# EAGLE schematic S7G7_footprint_simplified_w_ethernet_v1p18 (EAGLE 9.5.2)
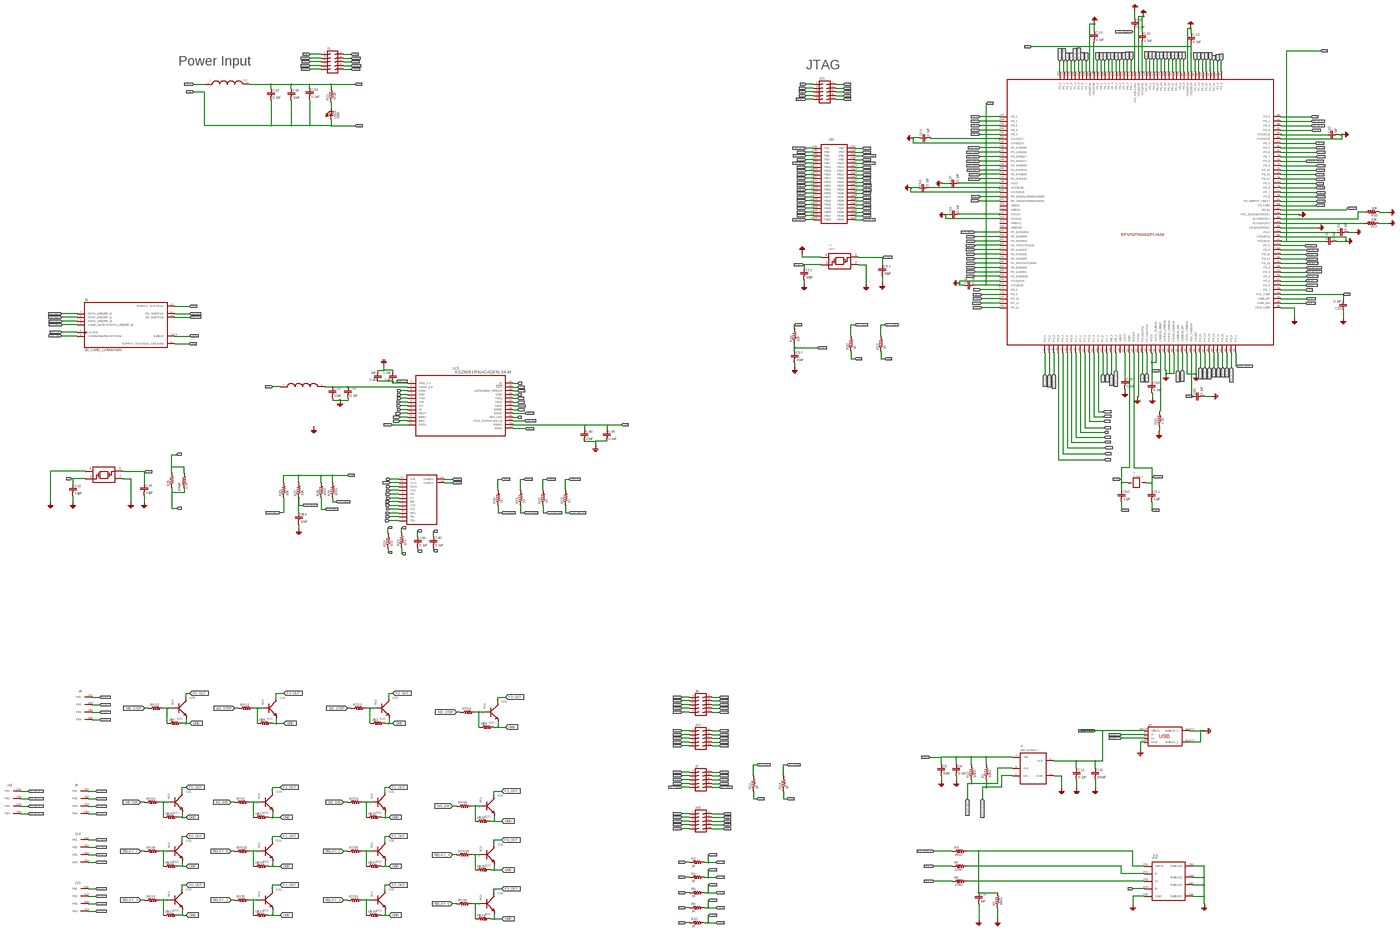
[diagram p0: schematic, sheet 1, overview]
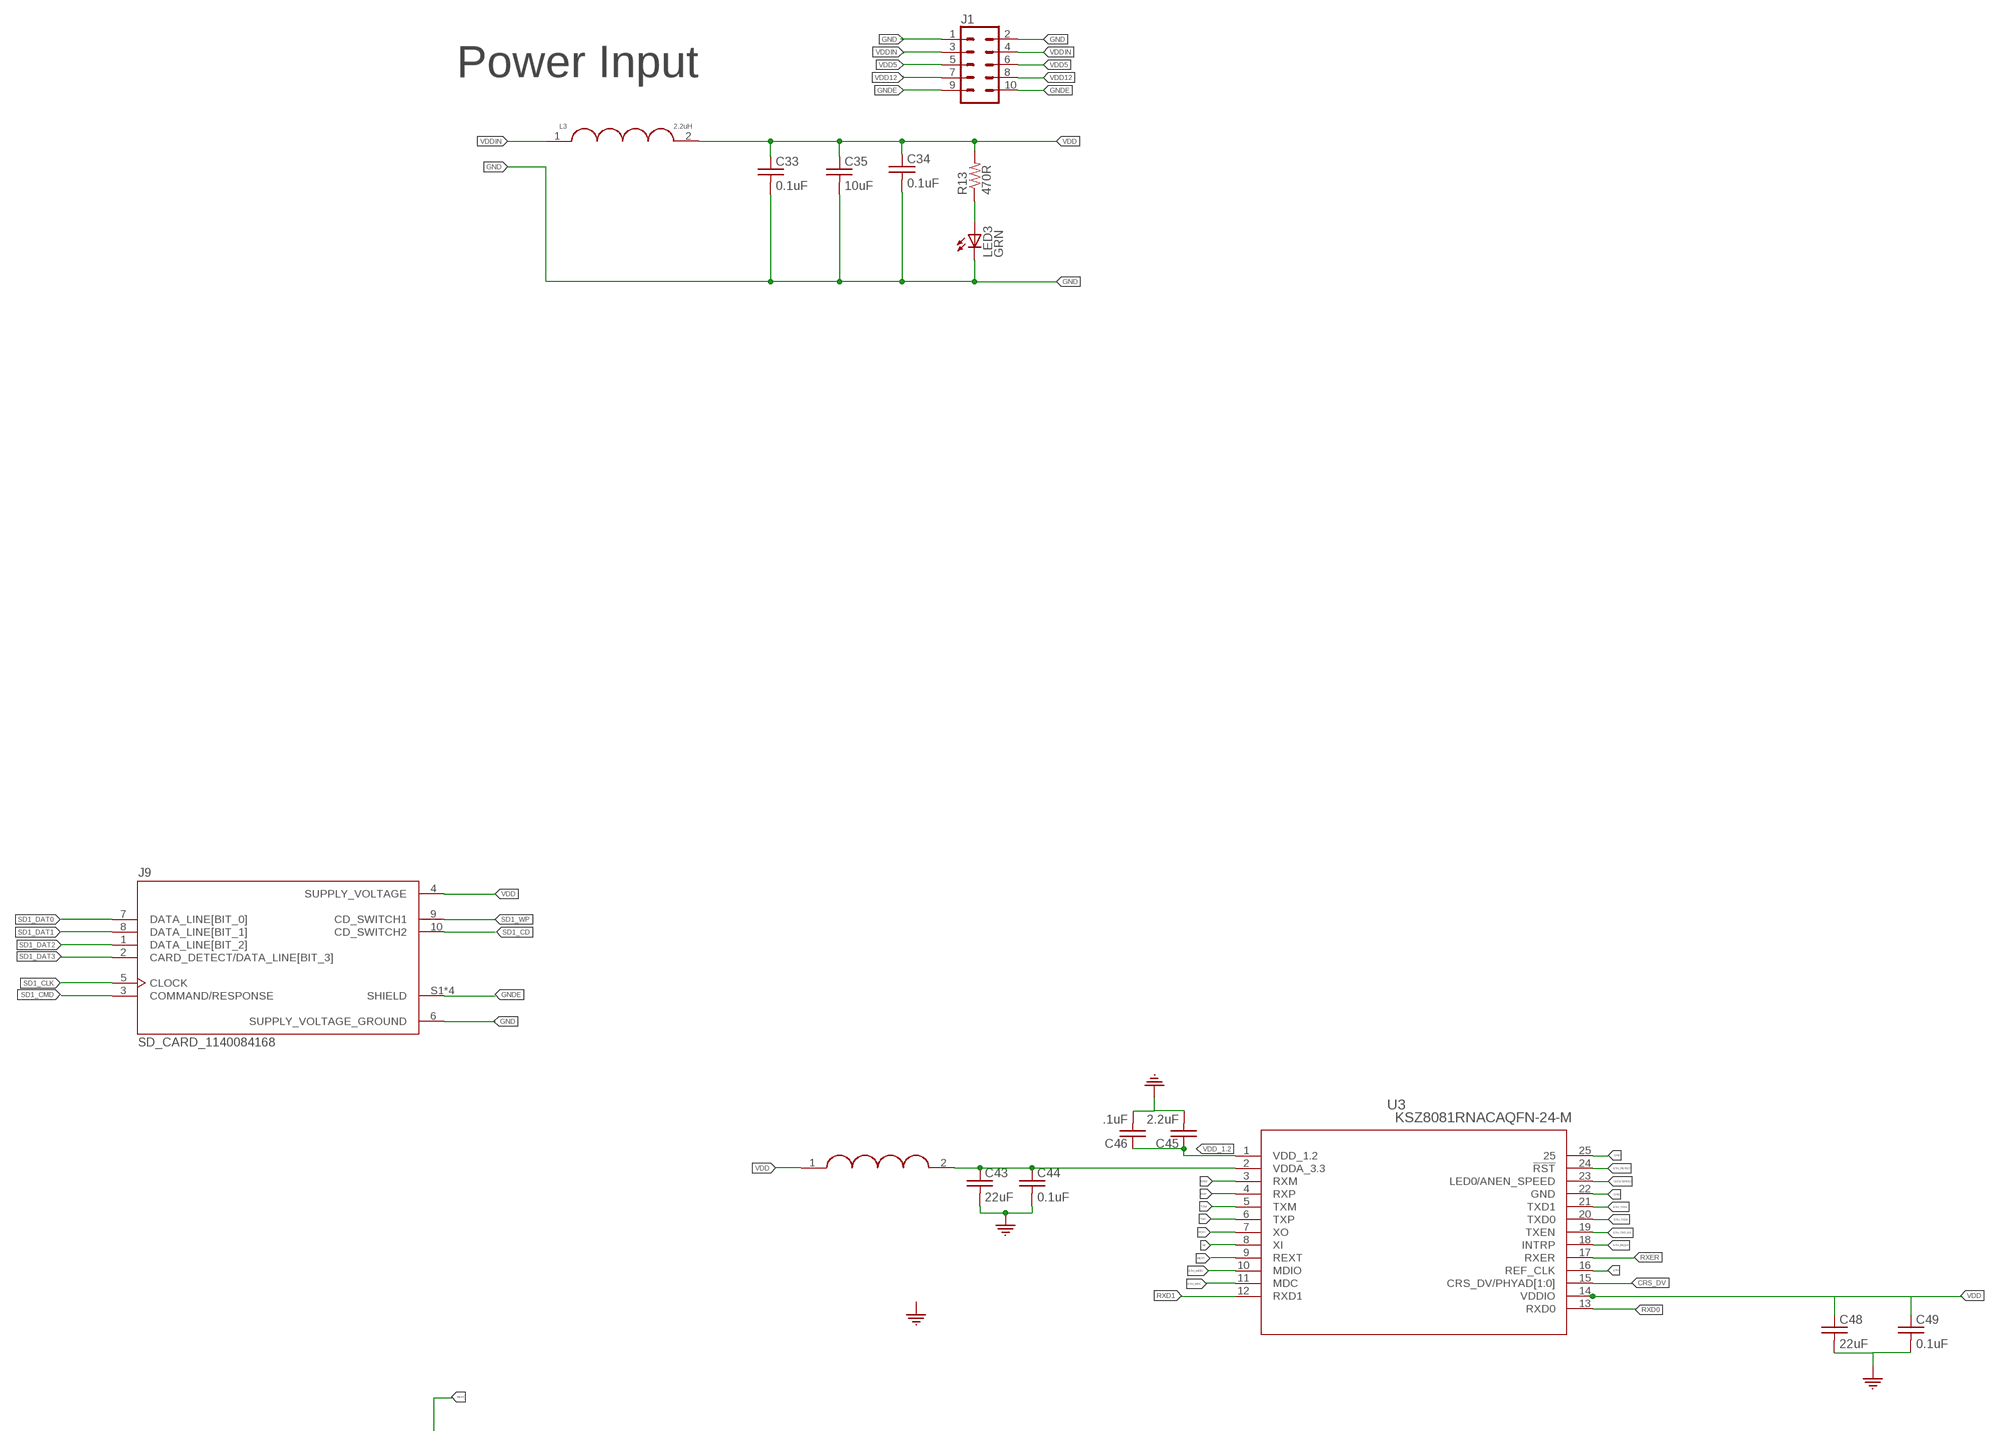
[diagram p1: schematic, sheet 1, part 1 of 4]
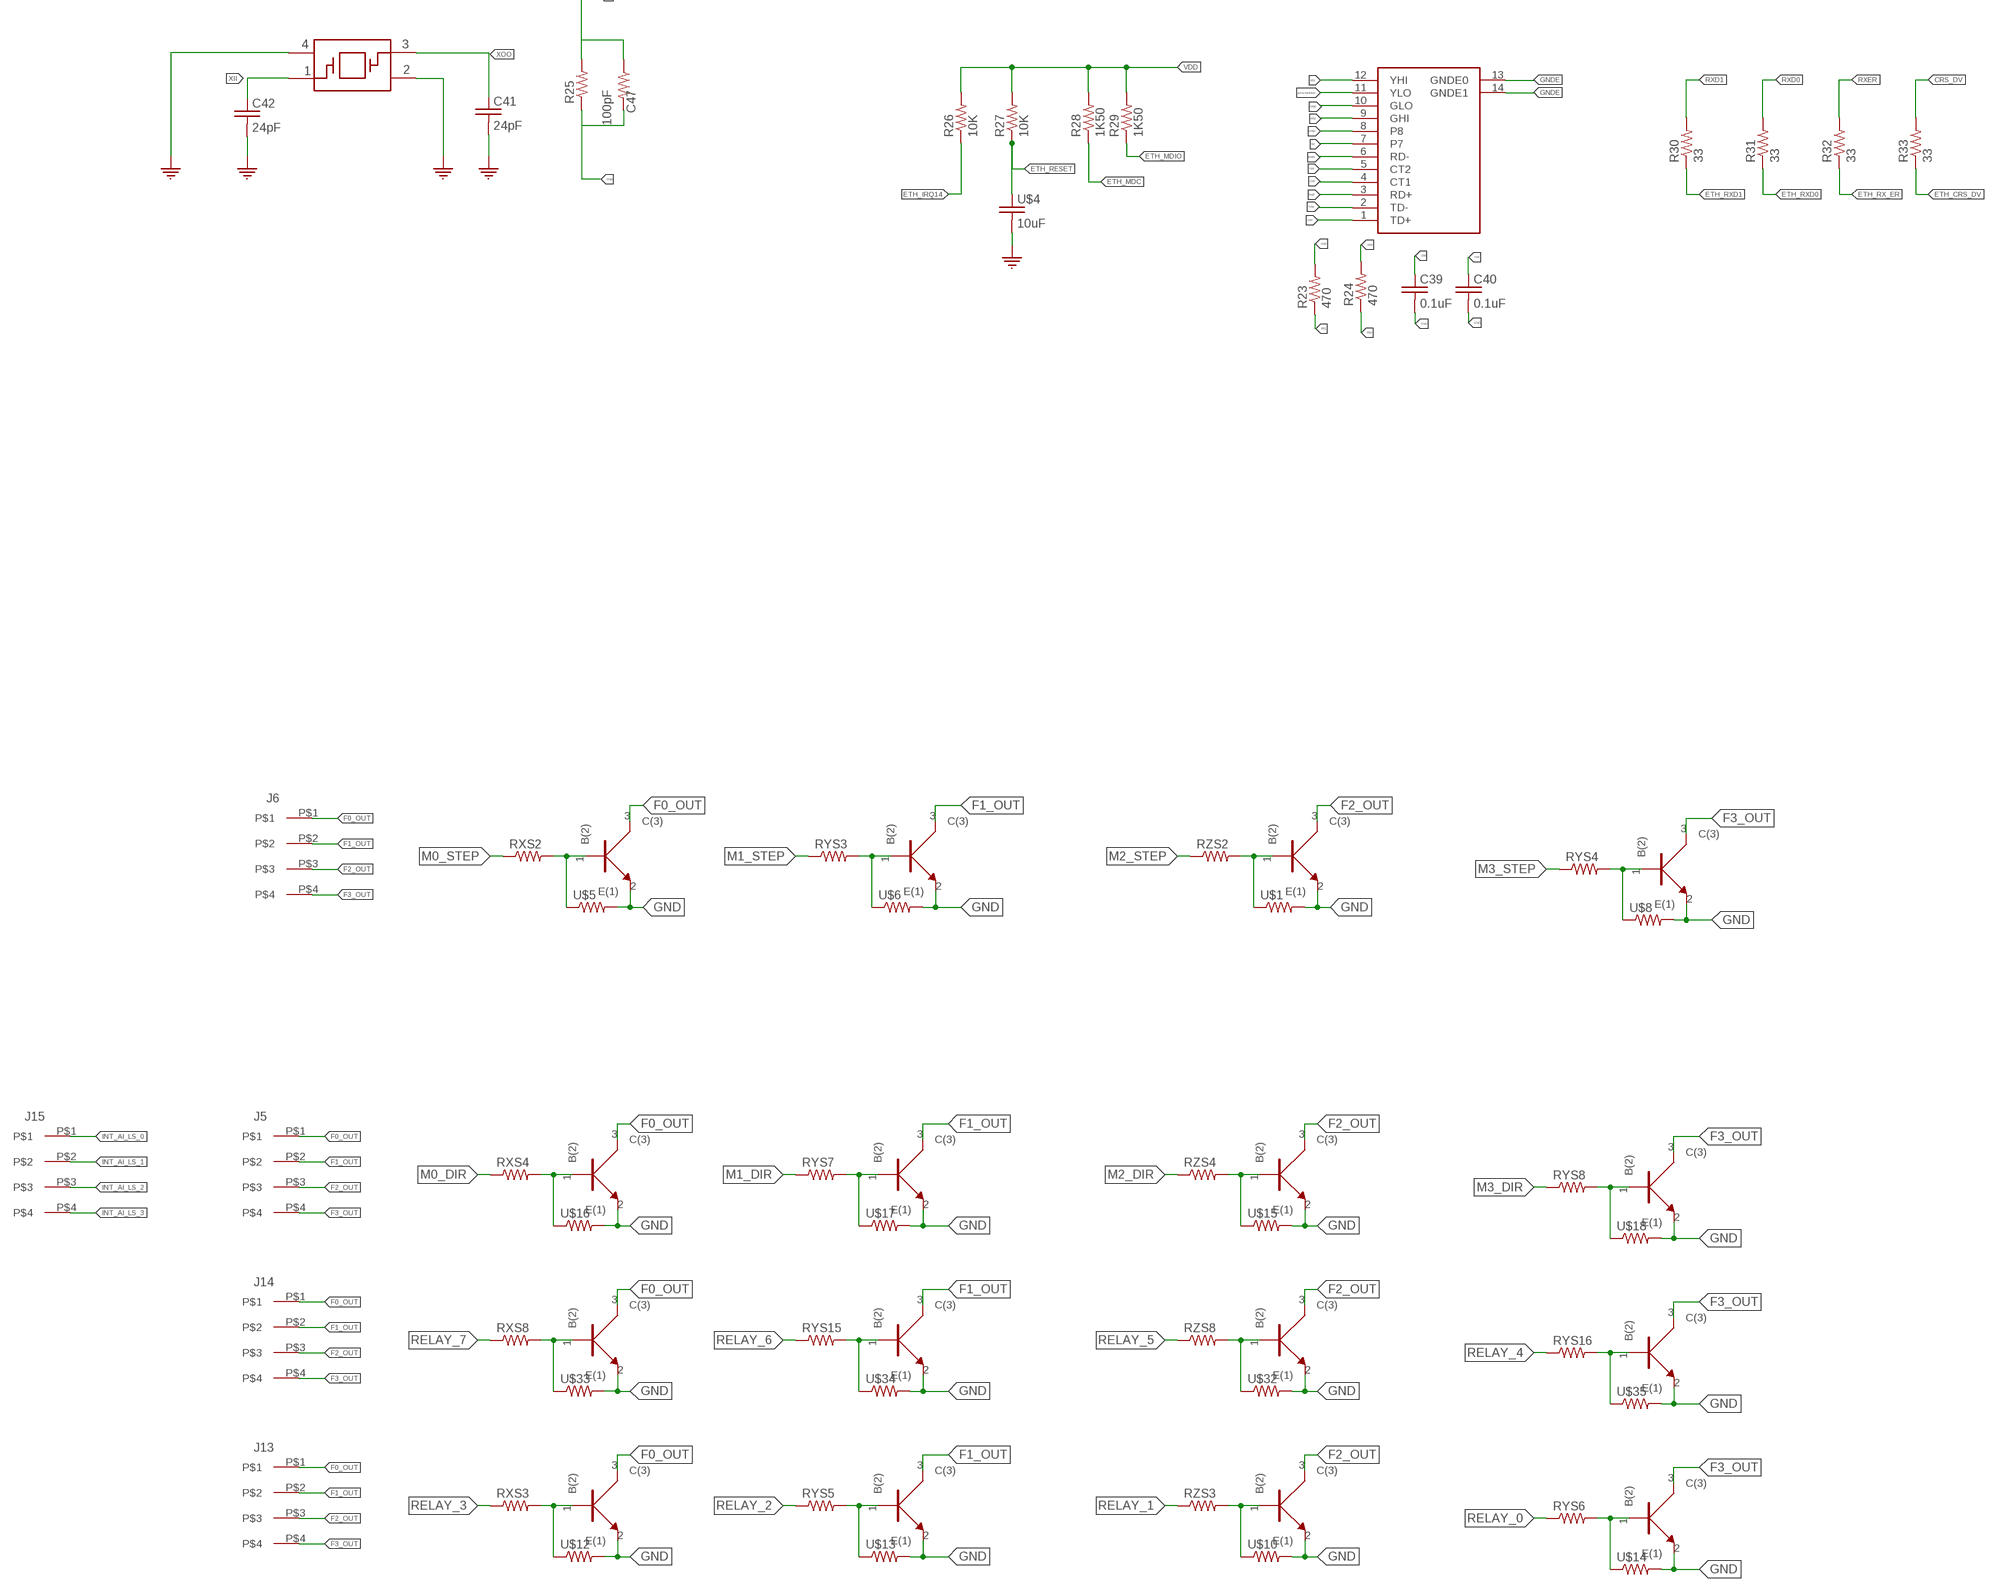
[diagram p2: schematic, sheet 1, part 2 of 4]
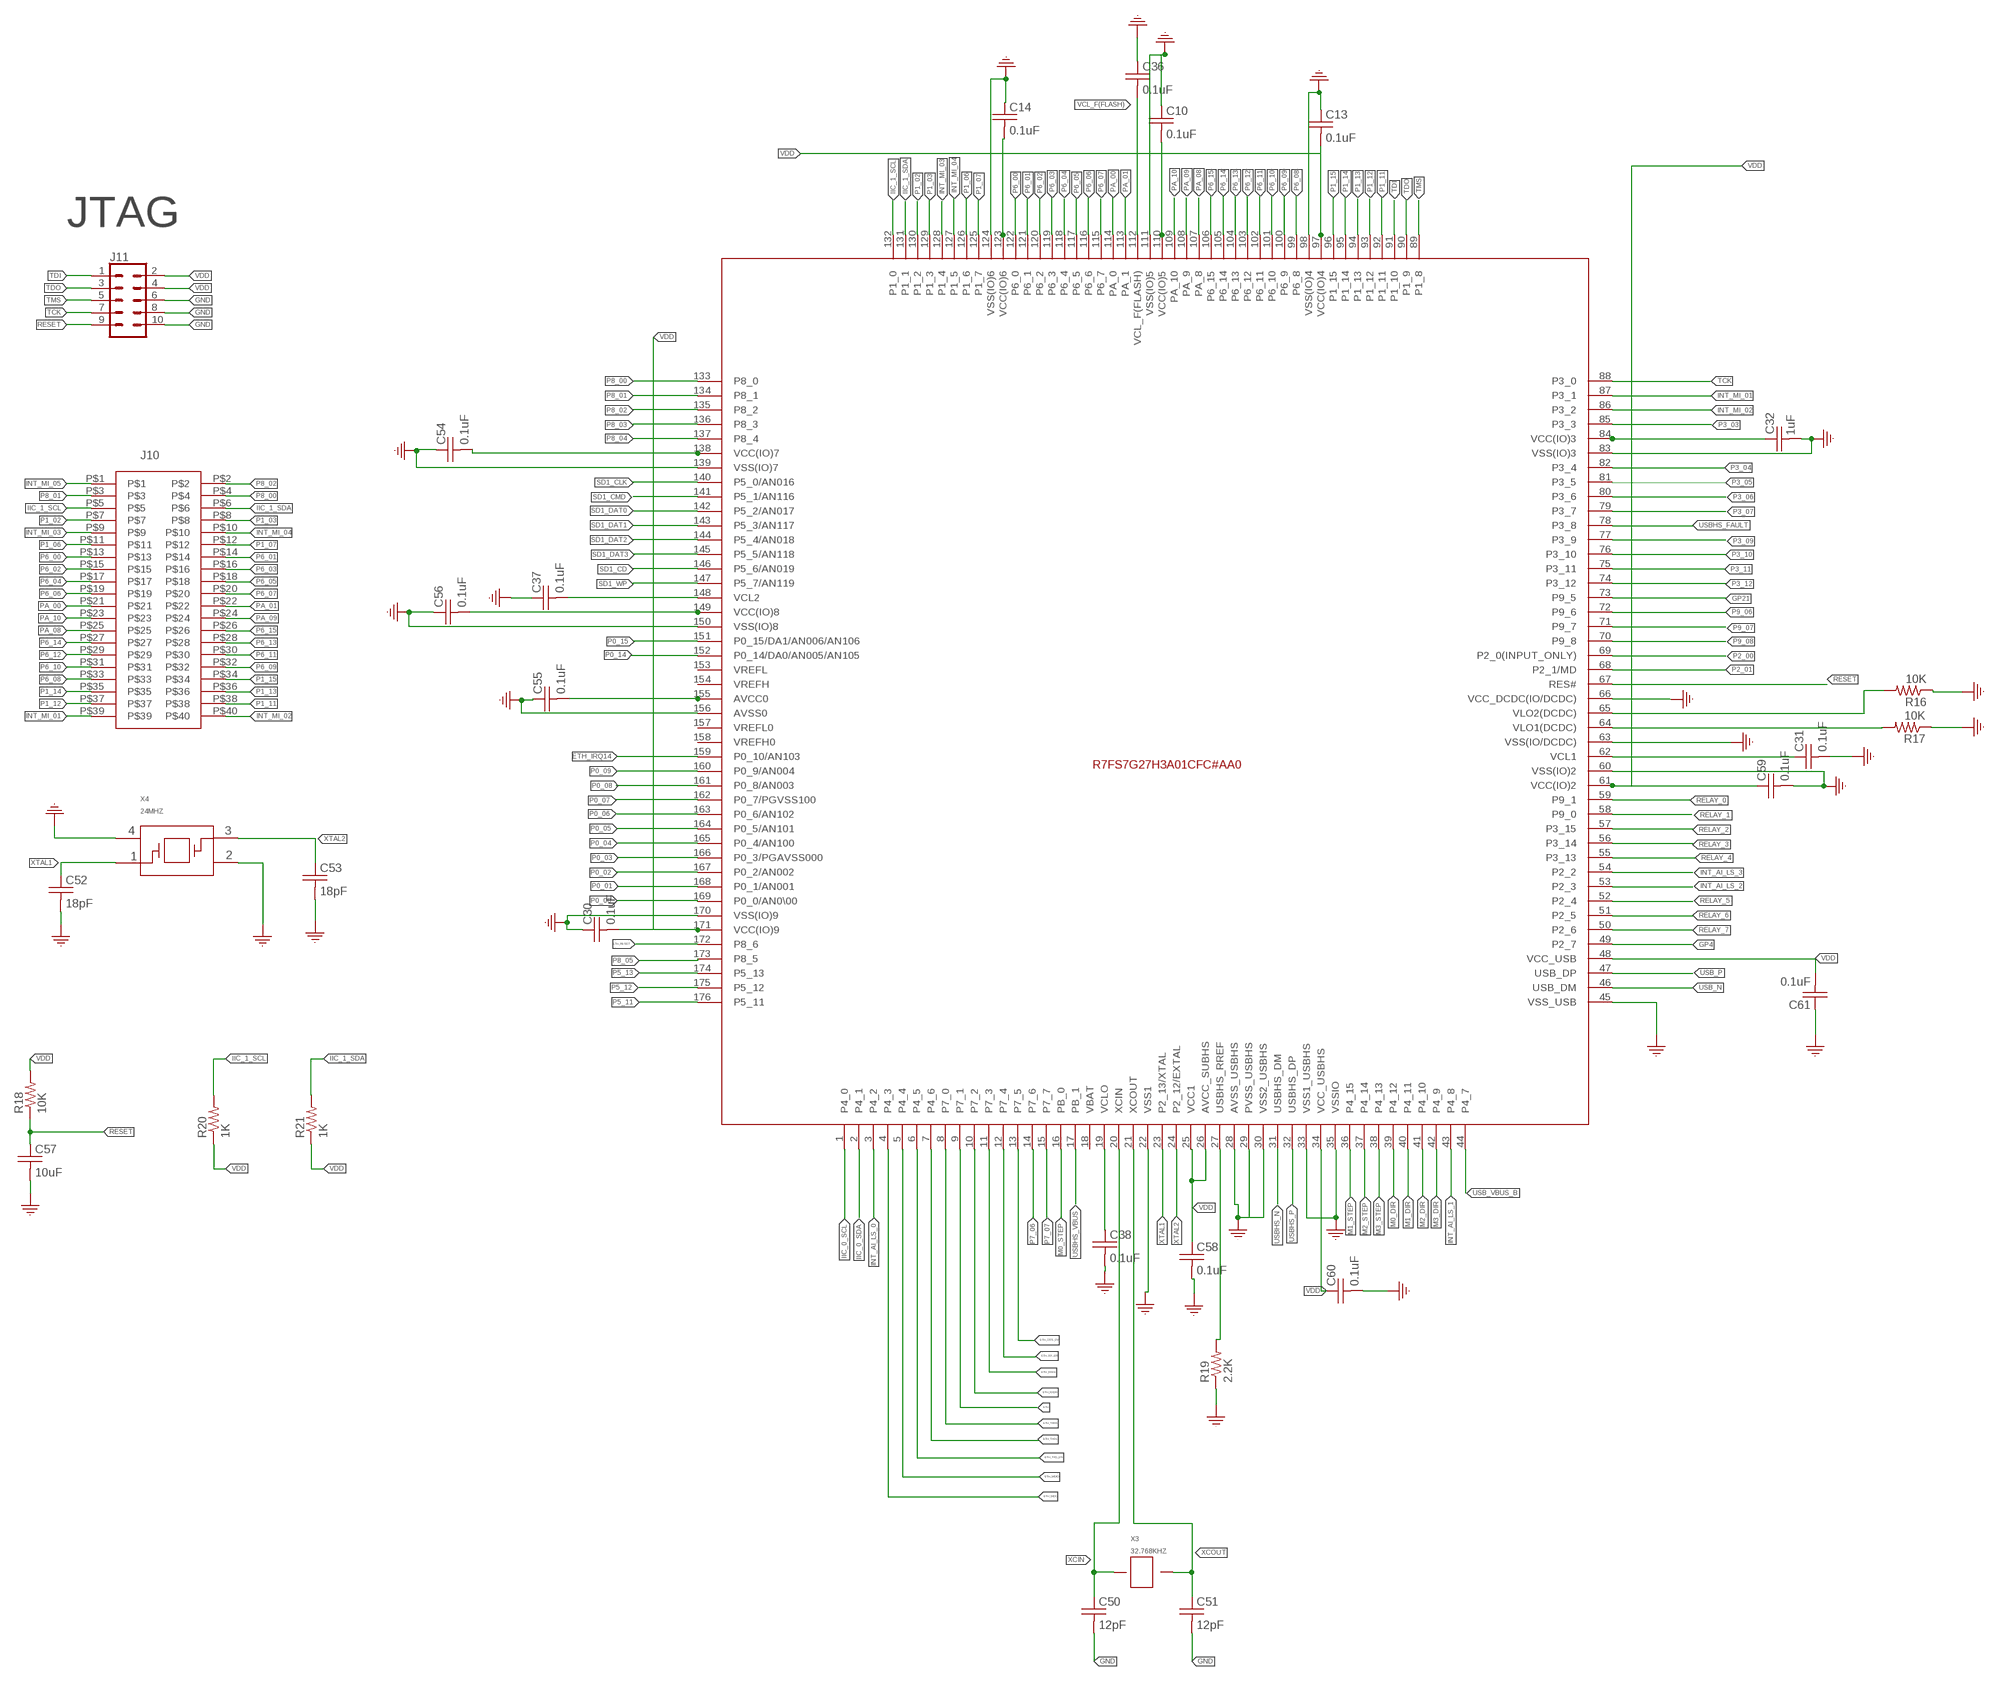
[diagram p3: schematic, sheet 1, part 3 of 4]
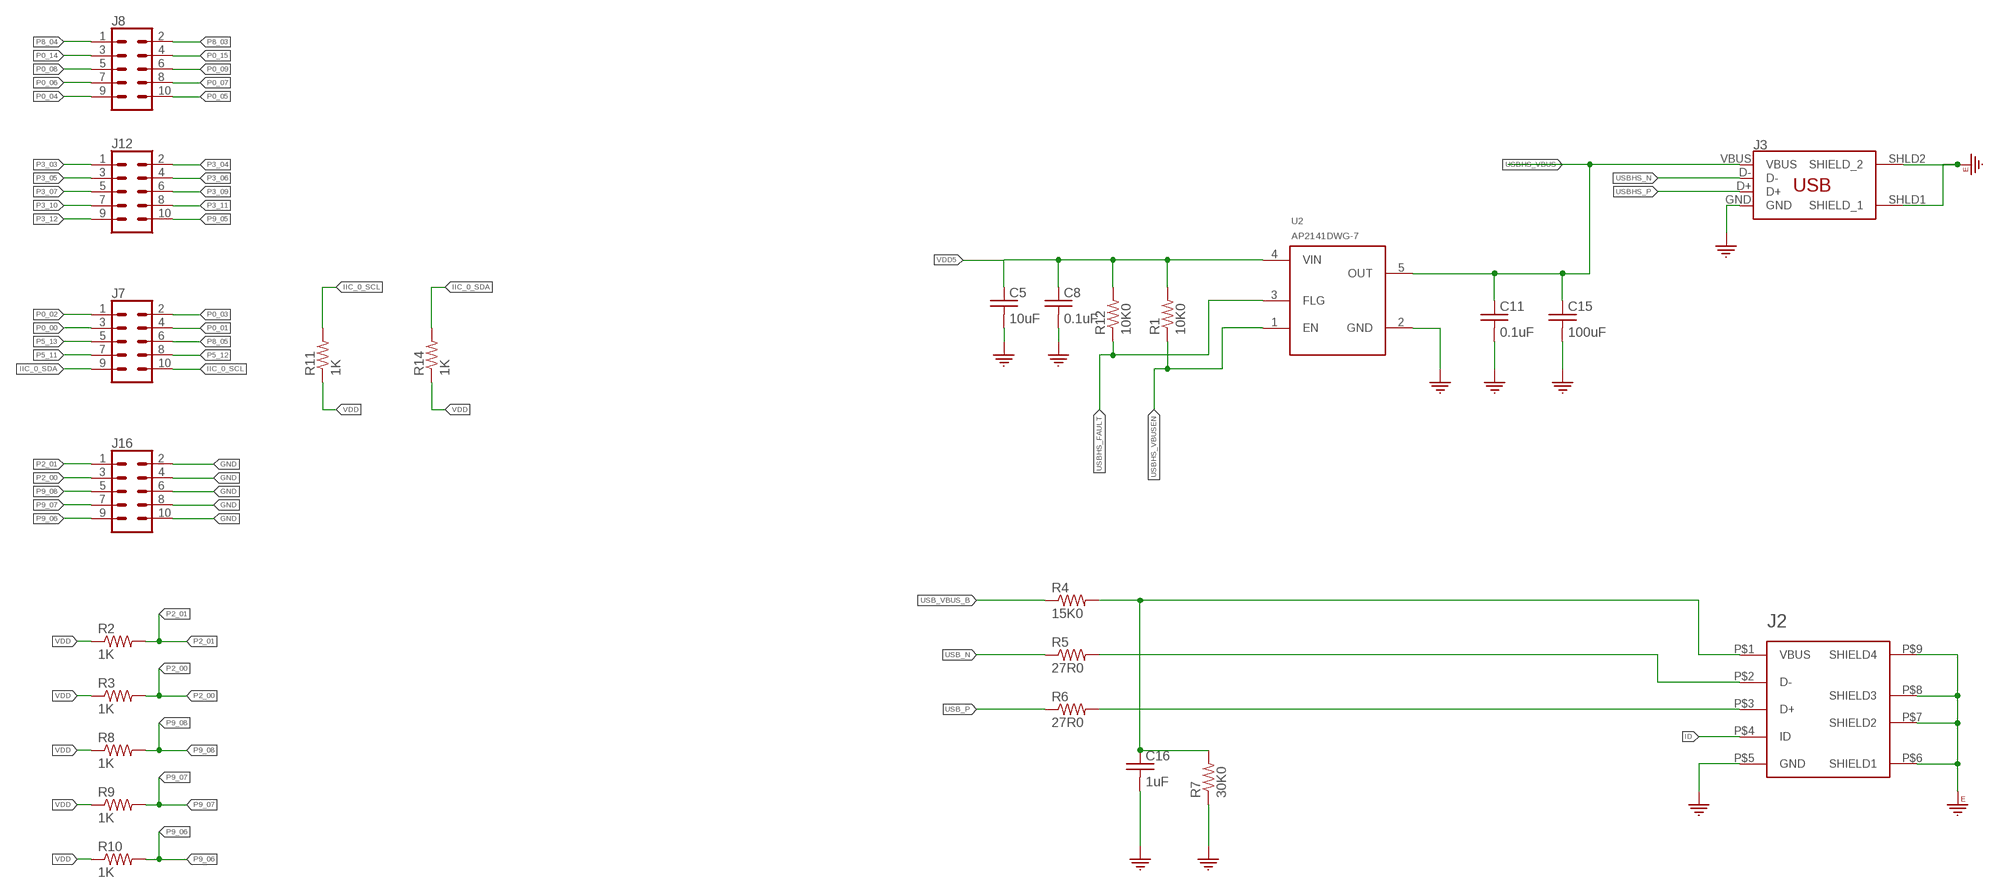
[diagram p4: schematic, sheet 1, part 4 of 4]

## Parts
C5  10uF  C_0402  [0402]
C8  0.1uF  C_0402  [0402]
C10  0.1uF  C_0402  [0402]
C11  0.1uF  C_0402  [0402]
C13  0.1uF  C_0402  [0402]
C14  0.1uF  C_0402  [0402]
C15  100uF  C_1210  [C1210]
C16  1uF  C_0402  [0402]
C30  0.1uF  C_0402  [0402]
C31  0.1uF  C_0402  [0402]
C32  1uF  C_0402  [0402]
C33  0.1uF  C_0402  [0402]
C34  0.1uF  C_0402  [0402]
C35  10uF  C_0402  [0402]
C36  0.1uF  C_0402  [0402]
C37  0.1uF  C_0402  [0402]
C38  0.1uF  C_0402  [0402]
C39  0.1uF  C_0402  [0402]
C40  0.1uF  C_0402  [0402]
C41  24pF  C_0402  [0402]
C42  24pF  C_0402  [0402]
C43  22uF  C_0603  [0603]
C44  0.1uF  C_0402  [0402]
C45  2.2uF  C_0402  [0402]
C46  .1uF  C_0402  [0402]
C47  100pF  R_0402  [0402]
C48  22uF  C_0603  [0603]
C49  0.1uF  C_0402  [0402]
C50  12pF  C_0402  [0402]
C51  12pF  C_0402  [0402]
C52  18pF  C_0402  [0402]
C53  18pF  C_0402  [0402]
C54  0.1uF  C_0402  [0402]
C55  0.1uF  C_0402  [0402]
C56  0.1uF  C_0402  [0402]
C57  10uF  C_0402  [0402]
C58  0.1uF  C_0402  [0402]
C59  0.1uF  C_0402  [0402]
C60  0.1uF  C_0402  [0402]
C61  0.1uF  C_0402  [0402]
FB2/2  FB_0805_120_OHM  [0805]
J1  CONN_05X2PTH  [2X5]
J2  USB_MICRO-B  [USB_MICRO-B]
J3  USB_A  [USB_A_SMT]
J4  RJ45_WITH_ELEC  [RJ45_TH_ELEC]
J5  3.81MM_1_X_4_RT_ANGLE_PLUG_HEADER  [1X4_3.81MM_PITCH]
J6  3.81MM_1_X_4_RT_ANGLE_PLUG_HEADER  [1X4_3.81MM_PITCH]
J7  CONN_05X2NO_SILK  [2X5_NOSILK]
J8  CONN_05X2NO_SILK  [2X5_NOSILK]
J9  SD_CARD_1140084168  [AMPHENOL_1140084168]
J10  HEADER_2_X_20_GENERIC  [HEADER_2_X_20_.1_INCH]
J11  CONN_05X2PTH  [2X5]
J12  CONN_05X2NO_SILK  [2X5_NOSILK]
J13  3.81MM_1_X_4_RT_ANGLE_PLUG_HEADER  [1X4_3.81MM_PITCH]
J14  3.81MM_1_X_4_RT_ANGLE_PLUG_HEADER  [1X4_3.81MM_PITCH]
J15  3.81MM_1_X_4_RT_ANGLE_PLUG_HEADER  [1X4_3.81MM_PITCH]
J16  CONN_05X2SHD_SMD  [2X5-SHROUDED_SMD]
L3  2.2uH  INDUCTOR_1008_2.2_MH_1.3A  [1008_(2520_METRIC)]
LED3  LED_0805_GREEN  [LED_0805_GREEN]
R1  10K0  R_0402  [0402]
R2  1K  R_0402  [0402]
R3  1K  R_0402  [0402]
R4  15K0  R_0402  [0402]
R5  27R0  R_0402  [0402]
R6  27R0  R_0402  [0402]
R7  30K0  R_0402  [0402]
R8  1K  R_0402  [0402]
R9  1K  R_0402  [0402]
R10  1K  R_0402  [0402]
R11  1K  R_0402  [0402]
R12  10K0  R_0402  [0402]
R13  470R  R_0402  [0402]
R14  1K  R_0402  [0402]
R16  10K  R_0402  [0402]
R17  10K  R_0402  [0402]
R18  10K  R_0402  [0402]
R19  2.2K  R_0402  [0402]
R20  1K  R_0402  [0402]
R21  1K  R_0402  [0402]
R23  470  R_0402  [0402]
R24  470  R_0402  [0402]
R25  6k49  R_0402  [0402]
R26  10K  R_0402  [0402]
R27  10K  R_0402  [0402]
R28  1K50  R_0402  [0402]
R29  1K50  R_0402  [0402]
R30  33  R_0402  [0402]
R31  33  R_0402  [0402]
R32  33  R_0402  [0402]
R33  33  R_0402  [0402]
RXS2  1K  R_0402  [0402]
RXS3  1K  R_0402  [0402]
RXS4  1K  R_0402  [0402]
RXS8  1K  R_0402  [0402]
RYS3  1K  R_0402  [0402]
RYS4  1K  R_0402  [0402]
RYS5  1K  R_0402  [0402]
RYS6  1K  R_0402  [0402]
RYS7  1K  R_0402  [0402]
RYS8  1K  R_0402  [0402]
RYS15  1K  R_0402  [0402]
RYS16  1K  R_0402  [0402]
RZS2  1K  R_0402  [0402]
RZS3  1K  R_0402  [0402]
RZS4  1K  R_0402  [0402]
RZS8  1K  R_0402  [0402]
U2  AP2141DWG-5  [SOT-23-5]
U3  KSZ8081RNACAQFN-24-M  [QFN-24-M]
U4  S7G2_X_176  [LQFP176_24X24]
U7  BC846BW  [SOT323]
U8  BC846BW  [SOT323]
U9  BC846BW  [SOT323]
U10  BC846BW  [SOT323]
U12  BC846BW  [SOT323]
U13  BC846BW  [SOT323]
U14  BC846BW  [SOT323]
U15  BC846BW  [SOT323]
U16  BC846BW  [SOT323]
U17  BC846BW  [SOT323]
U18  BC846BW  [SOT323]
U19  BC846BW  [SOT323]
U32  BC846BW  [SOT323]
U33  BC846BW  [SOT323]
U34  BC846BW  [SOT323]
U35  BC846BW  [SOT323]
U$1  1K  R_0402  [0402]
U$3  XTAL_25_MHZ  [SMD_3225]
U$4  10uF  C_0402  [0402]
U$5  1K  R_0402  [0402]
U$6  1K  R_0402  [0402]
U$8  1K  R_0402  [0402]
U$10  1K  R_0402  [0402]
U$12  1K  R_0402  [0402]
U$13  1K  R_0402  [0402]
U$14  1K  R_0402  [0402]
U$15  1K  R_0402  [0402]
U$16  1K  R_0402  [0402]
U$17  1K  R_0402  [0402]
U$18  1K  R_0402  [0402]
U$32  1K  R_0402  [0402]
U$33  1K  R_0402  [0402]
U$34  1K  R_0402  [0402]
U$35  1K  R_0402  [0402]
X3  32.768KHZ  XTAL_32.768KHZ  [SMD_X_2_PADS]
X4  24MHZ  XTAL_24_MHZ  [SMD_3225]

## Nets
C58: C39.P$1 J4.4(CT1)
C60: C40.P$1 J4.5(CT2)
CRS_DV: R33.P$2 U3.15(CRS_DV/PHYAD[1:0])
D+: J2.P$3(D+) R6.P$2
D-: J2.P$2(D-) R5.P$2
ETH: U3.16(REF_CLK) U4.9(P7_1)
ETH_CRS_DV: R33.P$1 U4.13(P7_5)
ETH_IRQ14: R26.P$1 U3.18(INTRP) U4.159(P0_10/AN103)
ETH_MDC: R28.P$1 U3.11(MDC) U4.4(P4_3)
ETH_MDIO: R29.P$1 U3.10(MDIO) U4.5(P4_4)
ETH_RESET: R27.P$1 U3.24(!RST) U4.172(P8_6) U$4.P$1
ETH_RX_ER: R32.P$1 U4.12(P7_4)
ETH_RXD0: R31.P$1 U4.10(P7_2)
ETH_RXD1: R30.P$1 U4.11(P7_3)
ETH_TXD0: U3.20(TXD0) U4.8(P7_0)
ETH_TXD1: U3.21(TXD1) U4.7(P4_6)
ETH_TXD_EN: U3.19(TXEN) U4.6(P4_5)
F0_OUT: J5.P$1 J6.P$1 J13.P$1 J14.P$1 U8.3(C(3)) U13.3(C(3)) U17.3(C(3)) U33.3(C(3))
F1_OUT: J5.P$2 J6.P$2 J13.P$2 J14.P$2 U9.3(C(3)) U14.3(C(3)) U18.3(C(3)) U34.3(C(3))
F2_OUT: J5.P$3 J6.P$3 J13.P$3 J14.P$3 U7.3(C(3)) U12.3(C(3)) U16.3(C(3)) U32.3(C(3))
F3_OUT: J5.P$4 J6.P$4 J13.P$4 J14.P$4 U10.3(C(3)) U15.3(C(3)) U19.3(C(3)) U35.3(C(3))
GND: C5.P$2 C8.P$2 C10.P$1 C11.P$2 C13.P$1 C14.P$1 C15.2 C16.P$2 C30.P$1 C31.P$2 C32.P$2 C33.P$2 C34.P$2 C35.P$2 C36.P$1 C37.P$1 C38.P$2 C39.P$2 C40.P$2 C41.P$2 C42.P$2 C43.2 C44.P$2 C45.P$2 C46.P$2 C47.P$2 C48.2 C49.P$2 C50.P$2 C51.P$2 C52.P$2 C53.P$2 C54.P$1 C55.P$1 C56.P$1 C57.P$2 C58.P$2 C59.P$2 C60.P$2 C61.P$1 J1.1 J1.2 J2.P$5(GND) J3.GND J4.8 J4.10(GLO) J9.6(SUPPLY_VOLTAGE_GROUND) J11.6 J11.8 J11.10 J16.2 J16.4 J16.6 J16.8 J16.10 LED3.C R7.P$1 R16.P$1 R17.P$1 R19.P$1 R25.P$1 U2.2(GND) U3.22(GND) U3.25 U4.22(VSS1) U4.28(AVSS_USBHS) U4.29(PVSS_USBHS) U4.30(VSS2_USBHS) U4.33(VSS1_USBHS) U4.35(VSSIO) U4.45(VSS_USB) U4.60(VSS(IO)2) U4.63(VSS(IO/DCDC)) U4.66(VCC_DCDC(IO/DCDC)) U4.83(VSS(IO)3) U4.98(VSS(IO)4) U4.111(VSS(IO)5) U4.124(VSS(IO)6) U4.139(VSS(IO)7) U4.150(VSS(IO)8) U4.156(AVSS0) U4.170(VSS(IO)9) U7.2(E(1)) U8.2(E(1)) U9.2(E(1)) U10.2(E(1)) U12.2(E(1)) U13.2(E(1)) U14.2(E(1)) U15.2(E(1)) U16.2(E(1)) U17.2(E(1)) U18.2(E(1)) U19.2(E(1)) U32.2(E(1)) U33.2(E(1)) U34.2(E(1)) U35.2(E(1)) U$1.P$2 U$3.2 U$3.4 U$4.P$2 U$5.P$2 U$6.P$2 U$8.P$2 U$10.P$2 U$12.P$2 U$13.P$2 U$14.P$2 U$15.P$2 U$16.P$2 U$17.P$2 U$18.P$2 U$32.P$2 U$33.P$2 U$34.P$2 U$35.P$2 X4.2 X4.4
GNDE: J1.9 J1.10 J2.P$6(SHIELD1) J2.P$7(SHIELD2) J2.P$8(SHIELD3) J2.P$9(SHIELD4) J3.SHLD1(SHIELD_1) J3.SHLD2(SHIELD_2) J4.13(GNDE0) J4.14(GNDE1) J9.S1(SHIELD) J9.S2(SHIELD) J9.S3(SHIELD) J9.S4(SHIELD)
GP4: U4.49(P2_7)
GP21: U4.73(P9_5)
ID: J2.P$4(ID)
IIC_0_SCL: J7.10 R11.P$2 U4.1(P4_0)
IIC_0_SDA: J7.9 R14.P$2 U4.2(P4_1)
IIC_1_SCL: J10.P$5 R20.P$2 U4.132(P1_0)
IIC_1_SDA: J10.P$6 R21.P$2 U4.131(P1_1)
INT_AI_LS_0: J15.P$1 U4.3(P4_2)
INT_AI_LS_1: J15.P$2 U4.43(P4_8)
INT_AI_LS_2: J15.P$3 U4.53(P2_3)
INT_AI_LS_3: J15.P$4 U4.54(P2_2)
INT_MI_01: J10.P$39 U4.87(P3_1)
INT_MI_02: J10.P$40 U4.86(P3_2)
INT_MI_03: J10.P$9 U4.128(P1_4)
INT_MI_04: J10.P$10 U4.127(P1_5)
INT_MI_05: J10.P$1
LED1/SPEED: J4.11(YLO) U3.23(LED0/ANEN_SPEED)
M0_DIR: RXS4.P$1 U4.39(P4_12)
M0_STEP: RXS2.P$1 U4.16(PB_0)
M1_DIR: RYS7.P$1 U4.40(P4_11)
M1_STEP: RYS3.P$1 U4.36(P4_15)
M2_DIR: RZS4.P$1 U4.41(P4_10)
M2_STEP: RZS2.P$1 U4.37(P4_14)
M3_DIR: RYS8.P$1 U4.42(P4_9)
M3_STEP: RYS4.P$1 U4.38(P4_13)
N$1: C37.P$2 U4.148(VCL2)
N$3: LED3.A R13.P$1
N$4: C38.P$1 U4.19(VCLO)
N$5: C31.P$1 U4.62(VCL1)
N$6: R17.P$2 U4.64(VLO1(DCDC))
N$7: R16.P$2 U4.65(VLO2(DCDC))
N$8: R19.P$2 U4.27(USBHS_RREF)
N$11: RZS2.P$2 U7.1(B(2)) U$1.P$1
N$12: RXS2.P$2 U8.1(B(2)) U$5.P$1
N$13: RYS3.P$2 U9.1(B(2)) U$6.P$1
N$14: RYS4.P$2 U10.1(B(2)) U$8.P$1
N$15: RZS3.P$2 U12.1(B(2)) U$10.P$1
N$16: RXS3.P$2 U13.1(B(2)) U$12.P$1
N$17: RYS5.P$2 U14.1(B(2)) U$13.P$1
N$18: RYS6.P$2 U15.1(B(2)) U$14.P$1
N$19: RZS4.P$2 U16.1(B(2)) U$15.P$1
N$20: RXS4.P$2 U17.1(B(2)) U$16.P$1
N$22: RYS7.P$2 U18.1(B(2)) U$17.P$1
N$23: RYS8.P$2 U19.1(B(2)) U$18.P$1
N$36: RZS8.P$2 U32.1(B(2)) U$32.P$1
N$37: RXS8.P$2 U33.1(B(2)) U$33.P$1
N$38: RYS15.P$2 U34.1(B(2)) U$34.P$1
N$39: RYS16.P$2 U35.1(B(2)) U$35.P$1
NC: J4.7
P0_00: J7.3 U4.169(P0_0/AN0\00)
P0_01: J7.4 U4.168(P0_1/AN001)
P0_02: J7.1 U4.167(P0_2/AN002)
P0_03: J7.2 U4.166(P0_3/PGAVSS000)
P0_04: J8.9 U4.165(P0_4/AN100)
P0_05: J8.10 U4.164(P0_5/AN101)
P0_06: J8.7 U4.163(P0_6/AN102)
P0_07: J8.8 U4.162(P0_7/PGVSS100)
P0_08: J8.5 U4.161(P0_8/AN003)
P0_09: J8.6 U4.160(P0_9/AN004)
P0_14: J8.3 U4.152(P0_14/DA0/AN005/AN105)
P0_15: J8.4 U4.151(P0_15/DA1/AN006/AN106)
P1_02: J10.P$7 U4.130(P1_2)
P1_03: J10.P$8 U4.129(P1_3)
P1_06: J10.P$11 U4.126(P1_6)
P1_07: J10.P$12 U4.125(P1_7)
P1_11: J10.P$38 U4.92(P1_11)
P1_12: J10.P$37 U4.93(P1_12)
P1_13: J10.P$36 U4.94(P1_13)
P1_14: J10.P$35 U4.95(P1_14)
P1_15: J10.P$34 U4.96(P1_15)
P2_00: J16.3 R3.P$2 U4.69(P2_0(INPUT_ONLY))
P2_01: J16.1 R2.P$2 U4.68(P2_1/MD)
P3_03: J12.1 U4.85(P3_3)
P3_04: J12.2 U4.82(P3_4)
P3_05: J12.3 U4.81(P3_5)
P3_06: J12.4 U4.80(P3_6)
P3_07: J12.5 U4.79(P3_7)
P3_09: J12.6 U4.77(P3_9)
P3_10: J12.7 U4.76(P3_10)
P3_11: J12.8 U4.75(P3_11)
P3_12: J12.9 U4.74(P3_12)
P5_11: J7.7 U4.176(P5_11)
P5_12: J7.8 U4.175(P5_12)
P5_13: J7.5 U4.174(P5_13)
P6_00: J10.P$13 U4.122(P6_0)
P6_01: J10.P$14 U4.121(P6_1)
P6_02: J10.P$15 U4.120(P6_2)
P6_03: J10.P$16 U4.119(P6_3)
P6_04: J10.P$17 U4.118(P6_4)
P6_05: J10.P$18 U4.117(P6_5)
P6_06: J10.P$19 U4.116(P6_6)
P6_07: J10.P$20 U4.115(P6_7)
P6_08: J10.P$33 U4.99(P6_8)
P6_09: J10.P$32 U4.100(P6_9)
P6_10: J10.P$31 U4.101(P6_10)
P6_11: J10.P$30 U4.102(P6_11)
P6_12: J10.P$29 U4.103(P6_12)
P6_13: J10.P$28 U4.104(P6_13)
P6_14: J10.P$27 U4.105(P6_14)
P6_15: J10.P$26 U4.106(P6_15)
P7_06: U4.14(P7_6)
P7_07: U4.15(P7_7)
P8_00: J10.P$4 U4.133(P8_0)
P8_01: J10.P$3 U4.134(P8_1)
P8_02: J10.P$2 U4.135(P8_2)
P8_03: J8.2 U4.136(P8_3)
P8_04: J8.1 U4.137(P8_4)
P8_05: J7.6 U4.173(P8_5)
P9_05: J12.10
P9_06: J16.9 R10.P$2 U4.72(P9_6)
P9_07: J16.7 R9.P$2 U4.71(P9_7)
P9_08: J16.5 R8.P$2 U4.70(P9_8)
PA_00: J10.P$21 U4.114(PA_0)
PA_01: J10.P$22 U4.113(PA_1)
PA_08: J10.P$25 U4.107(PA_8)
PA_09: J10.P$24 U4.108(PA_9)
PA_10: J10.P$23 U4.109(PA_10)
R51: J4.12(YHI) R23.P$1
R52: J4.9(GHI) R24.P$1
RELAY_0: RYS6.P$1 U4.59(P9_1)
RELAY_1: RZS3.P$1 U4.58(P9_0)
RELAY_2: RYS5.P$1 U4.57(P3_15)
RELAY_3: RXS3.P$1 U4.56(P3_14)
RELAY_4: RYS16.P$1 U4.55(P3_13)
RELAY_5: RZS8.P$1 U4.52(P2_4)
RELAY_6: RYS15.P$1 U4.51(P2_5)
RELAY_7: RXS8.P$1 U4.50(P2_6)
RESET: C57.P$1 J11.9 R18.P$1 U4.67(RES#)
REXT: C47.P$1 R25.P$2 U3.9(REXT)
RXD0: R31.P$2 U3.13(RXD0)
RXD1: R30.P$2 U3.12(RXD1)
RXER: R32.P$2 U3.17(RXER)
RXM: J4.6(RD-) U3.3(RXM)
RXP: J4.3(RD+) U3.4(RXP)
SD1_CD: J9.10(CD_SWITCH2) U4.146(P5_6/AN019)
SD1_CLK: J9.5(CLOCK) U4.140(P5_0/AN016)
SD1_CMD: J9.3(COMMAND/RESPONSE) U4.141(P5_1/AN116)
SD1_DAT0: J9.7(DATA_LINE[BIT_0]) U4.142(P5_2/AN017)
SD1_DAT1: J9.8(DATA_LINE[BIT_1]) U4.143(P5_3/AN117)
SD1_DAT2: J9.1(DATA_LINE[BIT_2]) U4.144(P5_4/AN018)
SD1_DAT3: J9.2(CARD_DETECT/DATA_LINE[BIT_3]) U4.145(P5_5/AN118)
SD1_WP: J9.9(CD_SWITCH1) U4.147(P5_7/AN119)
TCK: J11.7 U4.88(P3_0)
TDI: J11.1 U4.91(P1_10)
TDO: J11.3 U4.90(P1_9)
TMS: J11.5 U4.89(P1_8)
TXM: J4.2(TD-) U3.5(TXM)
TXP: J4.1(TD+) U3.6(TXP)
USB_N: R5.P$1 U4.46(USB_DM)
USB_P: R6.P$1 U4.47(USB_DP)
USB_VBUS_B: R4.P$1 U4.44(P4_7)
USBHS_FAULT: R12.P$1 U2.3(FLG) U4.78(P3_8)
USBHS_N: J3.D- U4.31(USBHS_DM)
USBHS_P: J3.D+ U4.32(USBHS_DP)
USBHS_VBUS: C11.P$1 C15.1 J3.VBUS U2.5(OUT) U4.17(PB_1)
USBHS_VBUSEN: R1.P$1 U2.1(EN)
VBUS: C16.P$1 J2.P$1(VBUS) R4.P$2 R7.P$2
VCL_F(FLASH): C36.P$2 U4.112(VCL_F(FLASH))
VDD: C10.P$2 C13.P$2 C14.P$2 C30.P$2 C32.P$1 C33.P$1 C34.P$1 C35.P$1 C48.1 C49.P$1 C54.P$2 C55.P$2 C56.P$2 C58.P$1 C59.P$1 C60.P$1 C61.P$2 FB2/2.1 J9.4(SUPPLY_VOLTAGE) J11.2 J11.4 L3.2 R2.P$1 R3.P$1 R8.P$1 R9.P$1 R10.P$1 R11.P$1 R13.P$2 R14.P$1 R18.P$2 R20.P$1 R21.P$1 R23.P$2 R24.P$2 R26.P$2 R27.P$2 R28.P$2 R29.P$2 U3.14(VDDIO) U4.25(VCC1) U4.26(AVCC_SUBHS) U4.34(VCC_USBHS) U4.48(VCC_USB) U4.61(VCC(IO)2) U4.84(VCC(IO)3) U4.97(VCC(IO)4) U4.110(VCC(IO)5) U4.123(VCC(IO)6) U4.138(VCC(IO)7) U4.149(VCC(IO)8) U4.155(AVCC0) U4.171(VCC(IO)9)
VDD5: C5.P$1 C8.P$1 J1.5 J1.6 R1.P$2 R12.P$2 U2.4(VIN)
VDD12: J1.7 J1.8
VDD_1.2: C45.P$1 C46.P$1 U3.1(VDD_1.2)
VDD_ENET1: C43.1 C44.P$1 FB2/2.2 U3.2(VDDA_3.3)
VDDIN: J1.3 J1.4 L3.1
XCIN: C50.P$1 U4.20(XCIN) X3.P$1
XCOUT: C51.P$1 U4.21(XCOUT) X3.P$2
XII: C42.P$1 U3.8(XI) U$3.1
XOO: C41.P$1 U3.7(XO) U$3.3
XTAL1: C52.P$1 U4.23(P2_13/XTAL) X4.1
XTAL2: C53.P$1 U4.24(P2_12/EXTAL) X4.3
Unconnected: U4.18(VBAT) U4.153(VREFL) U4.154(VREFH) U4.157(VREFL0) U4.158(VREFH0)

## Notes on the sheet
- Power Input | JTAG

## Library data of the parts
C5 C8 C10 C11 C13 C14 C16 C30-C42 C44-C46 C49-C61 U$4 = 3D_MIG_Controller:C_0402
C15 = 3D_MIG_Controller:C_1210
C43 C48 = 3D_MIG_Controller:C_0603
C47 R1-R14 R16-R21 R23-R33 RXS2-RXS4 RXS8 RYS3-RYS8 RYS15 RYS16 RZS2-RZS4 RZS8 U$1 U$5 U$6 U$8 U$10 U$12-U$18 U$32-U$35 = 3D_MIG_Controller:R_0402
FB2/2 = 3D_MIG_Controller:FB_0805_120_OHM
J1 J11 = 3D_MIG_Controller:CONN_05X2: Multi connection point. Often used as Generic Header-pin footprint for 0.1 inch spaced/style header connections For AVR SPI programming port, see special device with nice symbol: "AVR_SPI_PROG_5x2.dev" You can populate with any combo of single row headers, but if you'd like an exact match, check these: 2x5 AVR ICSP Male Header <https://www.sparkfun.com/products/778> (PRT-00778) 2x5 Pin Shrouded Header <https://www.sparkfun.com/products/8506> (PRT-08506) On any of the 0.1 inch spaced packages, you can populate with these: Break Away Headers - Straight <https://www.sparkfun.com/products/116> (PRT-00116) Break Away Male Headers - Right Angle <https://www.sparkfun.com/products/553> (PRT-00553) Female Headers <https://www.sparkfun.com/products/115> (PRT-00115) Break Away Headers - Machine Pin <https://www.sparkfun.com/products/117> (PRT-00117) Break Away Female Headers - Swiss Machine Pin <https://www.sparkfun.com/products/743> (PRT-00743) Special note: the shrouded connector mates well with our 5x2 ribbon cables: 2x5 Pin IDC Ribbon Cable <https://www.sparkfun.com/products/8535> (PRT-08535); PROD_ID: CONN-08499; SF_ID: PRT-0778
J2 = 3D_MIG_Controller:USB_MICRO-B
J3 = 3D_MIG_Controller:USB_A: USB-A Connector Male and female variants, as well as PTH and SMT variants SparkFun Products: SparkFun XBee Explorer Dongle <https://www.sparkfun.com/products/11697> PTH Male SparkFun MicroView-USB Programmer <https://www.sparkfun.com/products/12924> SMT Male SparkFun USB Type A Female Breakout <https://www.sparkfun.com/products/12700> SMT Female
J4 = 3D_MIG_Controller:RJ45_WITH_ELEC
J5 J6 J13-J15 = 3D_MIG_Controller:3.81MM_1_X_4_RT_ANGLE_PLUG_HEADER
J7 J8 J12 = 3D_MIG_Controller:CONN_05X2: Multi connection point. Often used as Generic Header-pin footprint for 0.1 inch spaced/style header connections For AVR SPI programming port, see special device with nice symbol: "AVR_SPI_PROG_5x2.dev" You can populate with any combo of single row headers, but if you'd like an exact match, check these: 2x5 AVR ICSP Male Header <https://www.sparkfun.com/products/778> (PRT-00778) 2x5 Pin Shrouded Header <https://www.sparkfun.com/products/8506> (PRT-08506) On any of the 0.1 inch spaced packages, you can populate with these: Break Away Headers - Straight <https://www.sparkfun.com/products/116> (PRT-00116) Break Away Male Headers - Right Angle <https://www.sparkfun.com/products/553> (PRT-00553) Female Headers <https://www.sparkfun.com/products/115> (PRT-00115) Break Away Headers - Machine Pin <https://www.sparkfun.com/products/117> (PRT-00117) Break Away Female Headers - Swiss Machine Pin <https://www.sparkfun.com/products/743> (PRT-00743) Special note: the shrouded connector mates well with our 5x2 ribbon cables: 2x5 Pin IDC Ribbon Cable <https://www.sparkfun.com/products/8535> (PRT-08535)
J9 = 3D_MIG_Controller:SD_CARD_1140084168: Conn; IC Socket; Micro SD; Right Angle; PCB Mount; MicroSD Ser.; DESCRIPTION: 10 _8 + 2_ Position Card Connector Secure Digital - microSD™ Surface Mount, Right Angle Gold; DIGI-KEY_PART_NUMBER: 114-00841-68-1-ND; DIGI-KEY_PURCHASE_URL: https://www.digikey.ae/product-detail/en/amphenol-icc-commercial-products/114-00841-68/114-00841-68-1-ND/2187101?utm_source=snapeda&utm_medium=aggregator&utm_campaign=symbol; MF: Amphenol ICC; MP: 114-00841-68; PACKAGE: None
J10 = 3D_MIG_Controller:HEADER_2_X_20_GENERIC
J16 = 3D_MIG_Controller:CONN_05X2: Multi connection point. Often used as Generic Header-pin footprint for 0.1 inch spaced/style header connections For AVR SPI programming port, see special device with nice symbol: "AVR_SPI_PROG_5x2.dev" You can populate with any combo of single row headers, but if you'd like an exact match, check these: 2x5 AVR ICSP Male Header <https://www.sparkfun.com/products/778> (PRT-00778) 2x5 Pin Shrouded Header <https://www.sparkfun.com/products/8506> (PRT-08506) On any of the 0.1 inch spaced packages, you can populate with these: Break Away Headers - Straight <https://www.sparkfun.com/products/116> (PRT-00116) Break Away Male Headers - Right Angle <https://www.sparkfun.com/products/553> (PRT-00553) Female Headers <https://www.sparkfun.com/products/115> (PRT-00115) Break Away Headers - Machine Pin <https://www.sparkfun.com/products/117> (PRT-00117) Break Away Female Headers - Swiss Machine Pin <https://www.sparkfun.com/products/743> (PRT-00743) Special note: the shrouded connector mates well with our 5x2 ribbon cables: 2x5 Pin IDC Ribbon Cable <https://www.sparkfun.com/products/8535> (PRT-08535); PROD_ID: CONN-09508
L3 = 3D_MIG_Controller:INDUCTOR_1008_2.2_MH_1.3A
LED3 = 3D_MIG_Controller:LED_0805_GREEN
U2 = 3D_MIG_Controller:AP2141DWG-5
U3 = 3D_MIG_Controller:KSZ8081RNACA; MANUFACTURER_PART_NUMBER: KSZ8081RNACA; VENDOR: Micrel
U4 = 3D_MIG_Controller:S7G2_X_176
U7-U10 U12-U19 U32-U35 = 3D_MIG_Controller:BC846BW; MANUFACTURER_PART_NUMBER: BC846BW; VENDOR: Nexperia
U$3 = 3D_MIG_Controller:XTAL_25_MHZ
X3 = 3D_MIG_Controller:XTAL_32.768KHZ
X4 = 3D_MIG_Controller:XTAL_24_MHZ